# Altium project Ultrascale.PrjPcb (part 1 of 9)
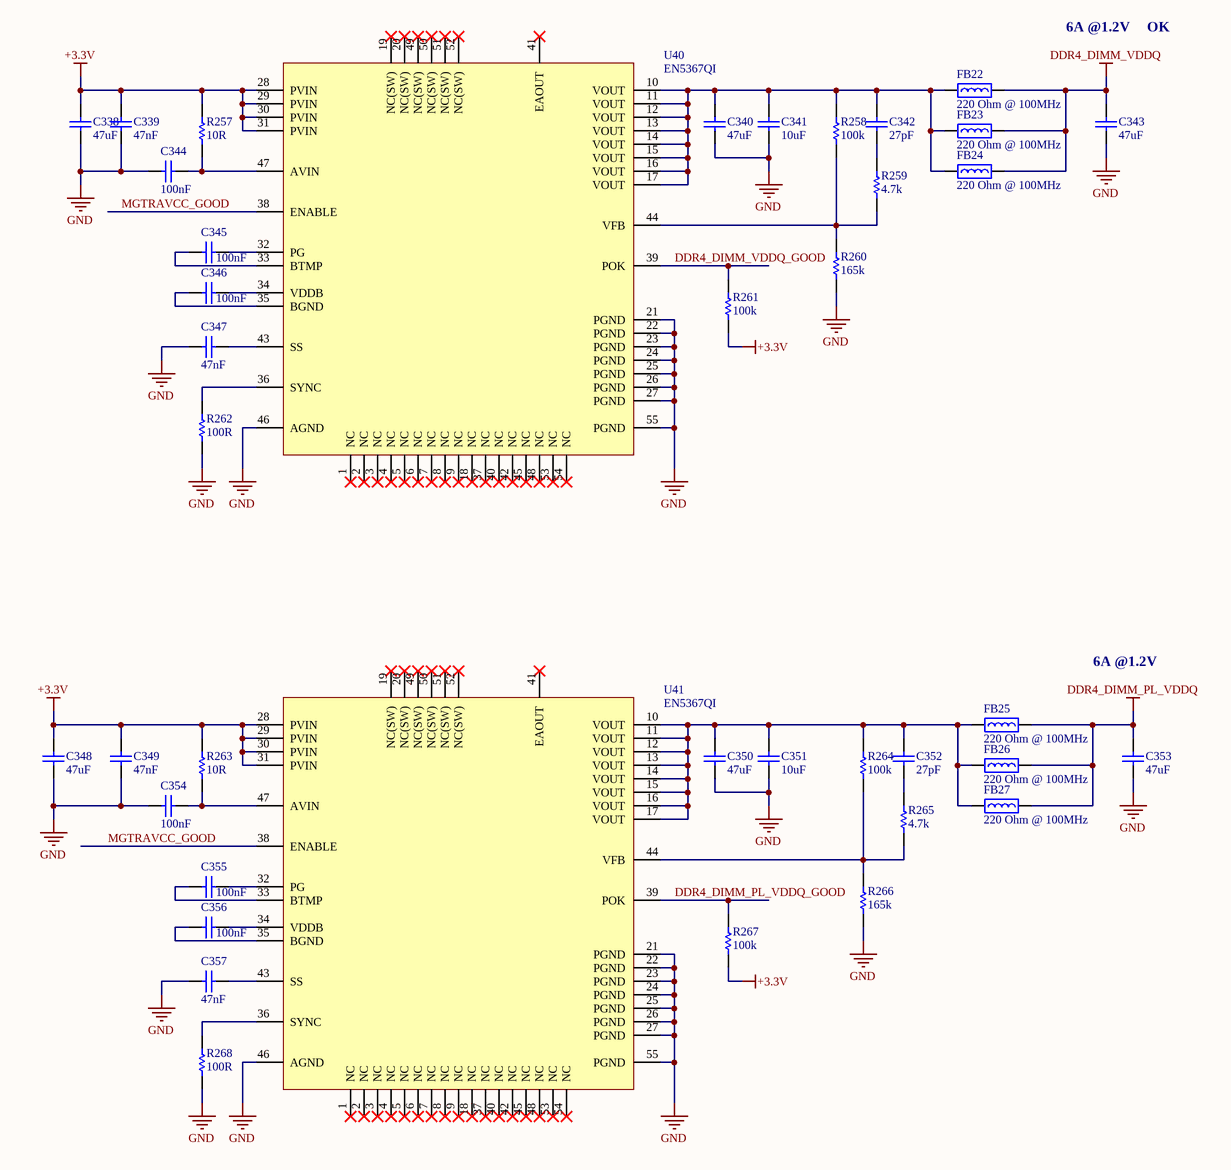
[diagram p0: Power1.SchDoc]
24 sheets, 926 parts. Net scope: global (net labels, ports and power ports of the same name join across sheets).
Board file: PCB1.PcbDoc
Sheets:
  Power1.SchDoc
  Power2.SchDoc
  Power3.SchDoc
  Power4.SchDoc
  DDR4_SODIMM_PWR.SchDoc
  Zynq_Power.SchDoc
  QSPI_EMMC_MICROSD.SchDoc
  JTAG.SchDoc
  SYSMON.SchDoc
  PS_DDR4_SODIMM.SchDoc
  PL_DDR4_SODIMM.SchDoc
  PS_DDR4.SchDoc
  PL_DDR4.SchDoc
  PS_GTR.SchDoc
  DisplayPort.SchDoc
  PL_IO.SchDoc
  PS_MIO.SchDoc
  USB3.0_UART.SchDoc
  PMOD_ARD_RASP.SchDoc
  eMMC_TPM.SchDoc
  Eth_Switch.SchDoc
  Eth_Switch_RJ45.SchDoc
  WIFI_BT.SchDoc
  ETH-PHY.SchDoc

## Sheet Power1.SchDoc
size A3

### Parts
C338  47uF  [CAPC3216L_1206]
C339  47nF  [CAPC2012L_0805]
C340  47uF  [CAPC3216L_1206]
C341  10uF  [CAPC1005L_0402]
C342  27pF  [CAPC1005L_0402]
C343  47uF  [CAPC3216L_1206]
C344  100nF  [CAPC1005L_0402]
C345  100nF  [CAPC1005L_0402]
C346  100nF  [CAPC1005L_0402]
C347  47nF  [CAPC2012L_0805]
C348  47uF  [CAPC3216L_1206]
C349  47nF  [CAPC2012L_0805]
C350  47uF  [CAPC3216L_1206]
C351  10uF  [CAPC1005L_0402]
C352  27pF  [CAPC1005L_0402]
C353  47uF  [CAPC3216L_1206]
C354  100nF  [CAPC1005L_0402]
C355  100nF  [CAPC1005L_0402]
C356  100nF  [CAPC1005L_0402]
C357  47nF  [CAPC2012L_0805]
FB22  Impedance @ Frequency: 220 Ohm @ 100MHz  [INDC1608N_0603]  (hidden comment: BEAD0603_220_2A5_40M)
FB23  Impedance @ Frequency: 220 Ohm @ 100MHz  [INDC1608N_0603]  (hidden comment: BEAD0603_220_2A5_40M)
FB24  Impedance @ Frequency: 220 Ohm @ 100MHz  [INDC1608N_0603]  (hidden comment: BEAD0603_220_2A5_40M)
FB25  Impedance @ Frequency: 220 Ohm @ 100MHz  [INDC1608N_0603]  (hidden comment: BEAD0603_220_2A5_40M)
FB26  Impedance @ Frequency: 220 Ohm @ 100MHz  [INDC1608N_0603]  (hidden comment: BEAD0603_220_2A5_40M)
FB27  Impedance @ Frequency: 220 Ohm @ 100MHz  [INDC1608N_0603]  (hidden comment: BEAD0603_220_2A5_40M)
R257  value 10R  [RESC1005L_0402]  (hidden comment: RES0402_10R_0W1_1T)
R258  value 100k  [RESC1005L_0402]  (hidden comment: RES0402_100K_0W2_1T)
R259  value 4.7k  [RESC1005L_0402]  (hidden comment: RES0402_4K7_0W1_1T)
R260  value 165k  [RESC1005L_0402]  (hidden comment: RES0402_165K_0W1_1T)
R261  value 100k  [RESC1005L_0402]  (hidden comment: RES0402_100K_0W2_1T)
R262  value 100R  [RESC1005L_0402]  (hidden comment: RES0402_100R_0W1_1T)
R263  value 10R  [RESC1005L_0402]  (hidden comment: RES0402_10R_0W1_1T)
R264  value 100k  [RESC1005L_0402]  (hidden comment: RES0402_100K_0W2_1T)
R265  value 4.7k  [RESC1005L_0402]  (hidden comment: RES0402_4K7_0W1_1T)
R266  value 165k  [RESC1005L_0402]  (hidden comment: RES0402_165K_0W1_1T)
R267  value 100k  [RESC1005L_0402]  (hidden comment: RES0402_100K_0W2_1T)
R268  value 100R  [RESC1005L_0402]  (hidden comment: RES0402_100R_0W1_1T)
U40  EN5367QI  [QFN54-EN5367QI]
U41  EN5367QI  [QFN54-EN5367QI]

### Nets
+3.3V: C338.2 C339.2 C348.2 C349.2 R257.2 R261.2 R263.2 R267.2 U40.28(PVIN) U40.29(PVIN) U40.30(PVIN) U40.31(PVIN) U41.28(PVIN) U41.29(PVIN) U41.30(PVIN) U41.31(PVIN)
DDR4_DIMM_PL_VDDQ: C353.2 FB25.2 FB26.2 FB27.2  [project net +VCCO_HP_64]
DDR4_DIMM_VDDQ: C343.2 FB22.2 FB23.2 FB24.2
GND: C338.1 C339.1 C340.1 C341.1 C343.1 C344.2 C347.2 C348.1 C349.1 C350.1 C351.1 C353.1 C354.2 C357.2 R260.1 R262.2 R266.1 R268.2 U40.21(PGND) U40.22(PGND) U40.23(PGND) U40.24(PGND) U40.25(PGND) U40.26(PGND) U40.27(PGND) U40.46(AGND) U40.55(PGND) U41.21(PGND) U41.22(PGND) U41.23(PGND) U41.24(PGND) U41.25(PGND) U41.26(PGND) U41.27(PGND) U41.46(AGND) U41.55(PGND)
DDR4_DIMM_PL_VDDQ_GOOD: R267.1 U41.39(POK)
DDR4_DIMM_VDDQ_GOOD: R261.1 U40.39(POK)
MGTRAVCC_GOOD: U40.38(ENABLE) U41.38(ENABLE)
NetC340_2: C340.2 C341.2 C342.2 FB22.1 FB23.1 FB24.1 R258.2 U40.10(VOUT) U40.11(VOUT) U40.12(VOUT) U40.13(VOUT) U40.14(VOUT) U40.15(VOUT) U40.16(VOUT) U40.17(VOUT)
NetC342_1: C342.1 R259.2
NetC344_1: C344.1 R257.1 U40.47(AVIN)
NetC345_1: C345.1 U40.32(PG)
NetC345_2: C345.2 U40.33(BTMP)
NetC346_1: C346.1 U40.34(VDDB)
NetC346_2: C346.2 U40.35(BGND)
NetC347_1: C347.1 U40.43(SS)
NetC350_2: C350.2 C351.2 C352.2 FB25.1 FB26.1 FB27.1 R264.2 U41.10(VOUT) U41.11(VOUT) U41.12(VOUT) U41.13(VOUT) U41.14(VOUT) U41.15(VOUT) U41.16(VOUT) U41.17(VOUT)
NetC352_1: C352.1 R265.2
NetC354_1: C354.1 R263.1 U41.47(AVIN)
NetC355_1: C355.1 U41.32(PG)
NetC355_2: C355.2 U41.33(BTMP)
NetC356_1: C356.1 U41.34(VDDB)
NetC356_2: C356.2 U41.35(BGND)
NetC357_1: C357.1 U41.43(SS)
NetR258_1: R258.1 R259.1 R260.2 U40.44(VFB)
NetR262_1: R262.1 U40.36(SYNC)
NetR264_1: R264.1 R265.1 R266.2 U41.44(VFB)
NetR268_1: R268.1 U41.36(SYNC)

Not connected (* = marked no-connect by the designer): U40 1(NC)* 2(NC)* 3(NC)* 4(NC)* 5(NC)* 6(NC)* 7(NC)* 8(NC)* 9(NC)* 18(NC)* 19(NC(SW))* 20(NC(SW))* 37(NC)* 40(NC)* 41(EAOUT)* 42(NC)* 45(NC)* 48(NC)* 49(NC(SW))* 50(NC(SW))* 51(NC(SW))* 52(NC(SW))* 53(NC)* 54(NC)*; U41 1(NC)* 2(NC)* 3(NC)* 4(NC)* 5(NC)* 6(NC)* 7(NC)* 8(NC)* 9(NC)* 18(NC)* 19(NC(SW))* 20(NC(SW))* 37(NC)* 40(NC)* 41(EAOUT)* 42(NC)* 45(NC)* 48(NC)* 49(NC(SW))* 50(NC(SW))* 51(NC(SW))* 52(NC(SW))* 53(NC)* 54(NC)*

### Notes on the sheet
- 6A @1.2V
- OK

### Library data of the parts
C338 C340 C343 C348 C350 C353 = CAPCER1206X5R47U25V_20T: CAP CER 47UF 25V X5R 1206; Manufacturer 1: TDK Corporation; Manufacturer Part Number 1: C3216X5R1E476M160AC; Tolerance: 20%; Package: 1206; ComponentLink1Description: Datasheet; Value: 47uF; Voltage: 25V; Temperature Coefficient: X5R; Supplier 1: Digi-Key; Supplier Part Number 1: 445-8047-1-ND; Operating Temperature: -55°C ~ 85°C
C339 C347 C349 C357 = CAPCER0805X5R47N50V_10T: CAP CER 0.047UF 50V X7R 0805; Manufacturer 1: Kemet; Manufacturer Part Number 1: C0805C473K5RACTU; Tolerance: 10%; Package: 0805; ComponentLink1Description: Datasheet; Value: 47nF; Voltage: 50V; Temperature Coefficient: X7R; Supplier 1: Digi-Key; Supplier Part Number 1: 399-1166-1-ND; Operating Temperature: -55°C ~ 125°C
C341 C351 = CAPCER0402X5R10U10V_20T: CAP CER 10UF 10V X5R 0402; Manufacturer 1: Samsung Electro-Mechanics America, Inc.; Manufacturer Part Number 1: CL05A106MP5NUNC; Tolerance: 20%; Package: 0402; ComponentLink1Description: Datasheet; Value: 10uF; Voltage: 10V; Temperature Coefficient: X5R; Supplier 1: Digi-Key; Supplier Part Number 1: 1276-1450-1-ND; Operating Temperature: -55°C ~ 85°C
C342 C352 = CAPCER0402C0G27P50V_5T: CAP CER 27PF 50V C0G/NP0 0402; Manufacturer 1: Murata Electronics North America; Manufacturer Part Number 1: GRM1555C1H270JA01D; Tolerance: 5%; Package: 0402; ComponentLink1Description: Datasheet; Value: 27pF; Voltage: 50V; Temperature Coefficient: C0G/NP0; Supplier 1: Digi-Key; Supplier Part Number 1: 490-5869-1-ND; Operating Temperature: -55°C ~ 125°C
C344-C346 C354-C356 = CAPCER0402X7R100N25V_10T: CAP CER 0.1UF 25V X7R 0402; Manufacturer 1: Murata Electronics North America; Manufacturer Part Number 1: GRM155R71E104KE14D; Tolerance: 10%; Package: 0402; ComponentLink1Description: Datasheet; Value: 100nF; Voltage: 25V; Temperature Coefficient: X7R; Supplier 1: Digi-Key; Supplier Part Number 1: 490-10698-1-ND; Operating Temperature: -55°C ~ 125°C
FB22-FB27 = BEAD0603_220_2A5_40M: FERRITE BEAD 220 OHM 0603 1LN; Manufacturer 1: Murata Electronics North America; Manufacturer Part Number 1: BLM18SG221TN1D; Current Rating (Max): 2.5A; DC Resistance (DCR) (Max): 40 mohm; Package: 0603; ComponentLink1Description: Datasheet; ComponentLink1URL: C:\Users\Public\Documents\Altium\AD16\Library\PDF\ENFA0003.pdf; Supplier 1: Digi-Key; Supplier Part Number 1: 490-5225-1-ND; Operating Temperature: -55°C ~ 125°C
R257 R263 = RES0402_10R_0W1_1T: RES SMD 10 OHM 1% 1/10W 0402; Manufacturer 1: Panasonic Electronic Components; Manufacturer Part Number 1: ERJ-2RKF10R0X; Package: 0402; ComponentLink1Description: Datasheet; Power: 1/10W; Tolerance: 1%; Supplier 1: Digi-Key; Supplier Part Number 1: P10.0LCT-ND
R258 R261 R264 R267 = RES0402_100K_0W2_1T: RES SMD 100K OHM 1% 1/5W 0402; Manufacturer 1: Vishay Dale; Manufacturer Part Number 1: RCS0402100KFKED; Package: 0402; ComponentLink1Description: Datasheet; Power: 1/5W; Tolerance: 1%; Supplier 1: Digi-Key; Supplier Part Number 1: 541-2899-1-ND
R259 R265 = RES0402_4K7_0W1_1T: RES SMD 4.7K OHM 1% 1/10W 0402; Manufacturer 1: Panasonic Electronic Components; Manufacturer Part Number 1: ERJ-2RKF4701X; Package: 0402; ComponentLink1Description: Datasheet; Power: 1/10W; Tolerance: 1%; Supplier 1: Digi-Key; Supplier Part Number 1: P4.70KLCT-ND
R260 R266 = RES0402_165K_0W1_1T: RES SMD 165K OHM 1% 1/10W 0402; Manufacturer 1: Panasonic Electronic Components; Manufacturer Part Number 1: ERJ-2RKF1653X; Package: 0402; ComponentLink1Description: Datasheet; Power: 1/10W; Tolerance: ±1%; Supplier 1: Digikey; Supplier Part Number 1: P165KLCT-ND
R262 R268 = RES0402_100R_0W1_1T: RES SMD 100 OHM 1% 1/10W 0402; Manufacturer 1: Panasonic Electronic Components; Manufacturer Part Number 1: ERJ-2RKF1000X; Package: 0402; ComponentLink1Description: Datasheet; Power: 1/10W; Tolerance: 1%; Supplier 1: Digi-Key; Supplier Part Number 1: P100LCT-ND
U40 U41 = EN5367QI: DC/DC CONVERTER 0.6-4.9V 29W; Manufacturer 1: Altera; Voltage - Output: 0.6 ~ 4.9 V; Voltage - Input: 2.5V - 5.5V; ComponentLink1Description: Datasheet; ComponentLink1URL: C:\Users\Public\Documents\Altium\AD16\Library\PDF\en5367qi_07013.pdf; Supplier 1: Digi-Key; Supplier Part Number 1: 544-2858-1-ND; Manufacturer Part Number 1: EN5367QI; Operating Temperature: -40°C ~ 85°C

## Sheet Power2.SchDoc
size A3
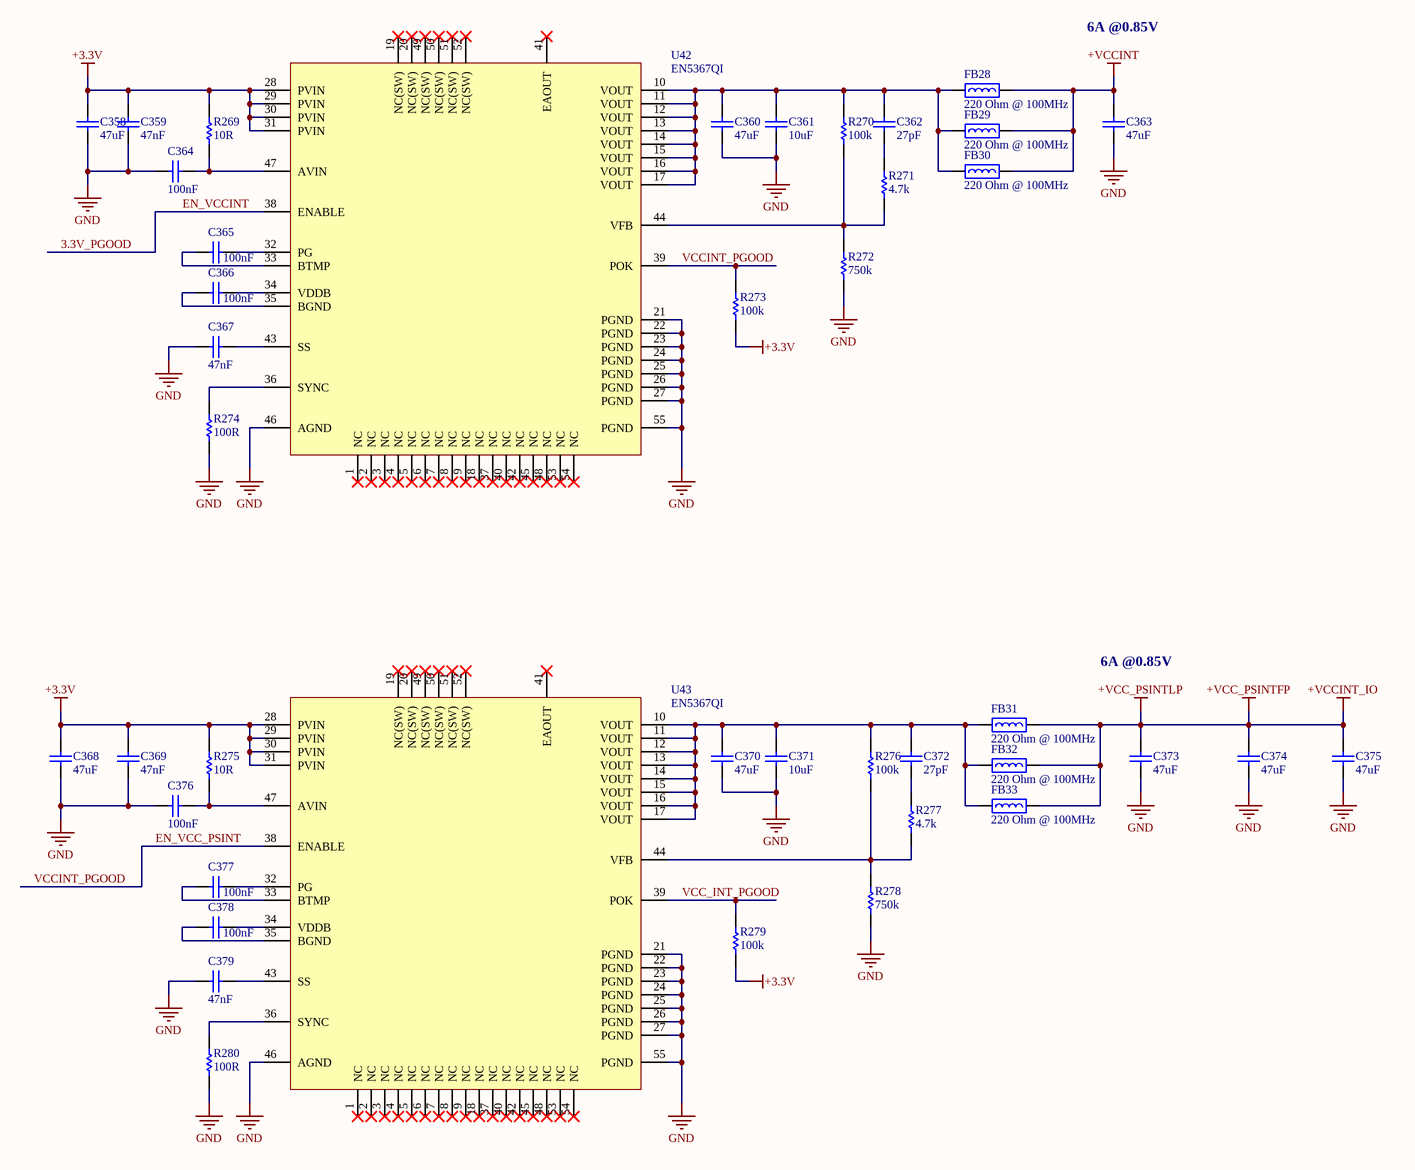
[diagram p1: Power2.SchDoc]

### Parts
C358  47uF  [CAPC3216L_1206]
C359  47nF  [CAPC2012L_0805]
C360  47uF  [CAPC3216L_1206]
C361  10uF  [CAPC1005L_0402]
C362  27pF  [CAPC1005L_0402]
C363  47uF  [CAPC3216L_1206]
C364  100nF  [CAPC1005L_0402]
C365  100nF  [CAPC1005L_0402]
C366  100nF  [CAPC1005L_0402]
C367  47nF  [CAPC2012L_0805]
C368  47uF  [CAPC3216L_1206]
C369  47nF  [CAPC2012L_0805]
C370  47uF  [CAPC3216L_1206]
C371  10uF  [CAPC1005L_0402]
C372  27pF  [CAPC1005L_0402]
C373  47uF  [CAPC3216L_1206]
C374  47uF  [CAPC3216L_1206]
C375  47uF  [CAPC3216L_1206]
C376  100nF  [CAPC1005L_0402]
C377  100nF  [CAPC1005L_0402]
C378  100nF  [CAPC1005L_0402]
C379  47nF  [CAPC2012L_0805]
FB28  Impedance @ Frequency: 220 Ohm @ 100MHz  [INDC1608N_0603]  (hidden comment: BEAD0603_220_2A5_40M)
FB29  Impedance @ Frequency: 220 Ohm @ 100MHz  [INDC1608N_0603]  (hidden comment: BEAD0603_220_2A5_40M)
FB30  Impedance @ Frequency: 220 Ohm @ 100MHz  [INDC1608N_0603]  (hidden comment: BEAD0603_220_2A5_40M)
FB31  Impedance @ Frequency: 220 Ohm @ 100MHz  [INDC1608N_0603]  (hidden comment: BEAD0603_220_2A5_40M)
FB32  Impedance @ Frequency: 220 Ohm @ 100MHz  [INDC1608N_0603]  (hidden comment: BEAD0603_220_2A5_40M)
FB33  Impedance @ Frequency: 220 Ohm @ 100MHz  [INDC1608N_0603]  (hidden comment: BEAD0603_220_2A5_40M)
R269  value 10R  [RESC1005L_0402]  (hidden comment: RES0402_10R_0W1_1T)
R270  value 100k  [RESC1005L_0402]  (hidden comment: RES0402_100K_0W2_1T)
R271  value 4.7k  [RESC1005L_0402]  (hidden comment: RES0402_4K7_0W1_1T)
R272  value 750k  [RESC1005L_0402]  (hidden comment: RES0402_750K_0W1_1T)
R273  value 100k  [RESC1005L_0402]  (hidden comment: RES0402_100K_0W2_1T)
R274  value 100R  [RESC1005L_0402]  (hidden comment: RES0402_100R_0W1_1T)
R275  value 10R  [RESC1005L_0402]  (hidden comment: RES0402_10R_0W1_1T)
R276  value 100k  [RESC1005L_0402]  (hidden comment: RES0402_100K_0W2_1T)
R277  value 4.7k  [RESC1005L_0402]  (hidden comment: RES0402_4K7_0W1_1T)
R278  value 750k  [RESC1005L_0402]  (hidden comment: RES0402_750K_0W1_1T)
R279  value 100k  [RESC1005L_0402]  (hidden comment: RES0402_100K_0W2_1T)
R280  value 100R  [RESC1005L_0402]  (hidden comment: RES0402_100R_0W1_1T)
U42  EN5367QI  [QFN54-EN5367QI]
U43  EN5367QI  [QFN54-EN5367QI]

### Nets
+3.3V: C358.2 C359.2 C368.2 C369.2 R269.2 R273.2 R275.2 R279.2 U42.28(PVIN) U42.29(PVIN) U42.30(PVIN) U42.31(PVIN) U43.28(PVIN) U43.29(PVIN) U43.30(PVIN) U43.31(PVIN)
+VCC_PSINTFP: C373.2 C374.2 C375.2 FB31.2 FB32.2 FB33.2  [also labelled +VCC_PSINTLP, +VCCINT_IO]
+VCCINT: C363.2 FB28.2 FB29.2 FB30.2
GND: C358.1 C359.1 C360.1 C361.1 C363.1 C364.2 C367.2 C368.1 C369.1 C370.1 C371.1 C373.1 C374.1 C375.1 C376.2 C379.2 R272.1 R274.2 R278.1 R280.2 U42.21(PGND) U42.22(PGND) U42.23(PGND) U42.24(PGND) U42.25(PGND) U42.26(PGND) U42.27(PGND) U42.46(AGND) U42.55(PGND) U43.21(PGND) U43.22(PGND) U43.23(PGND) U43.24(PGND) U43.25(PGND) U43.26(PGND) U43.27(PGND) U43.46(AGND) U43.55(PGND)
3.3V_PGOOD: U42.38(ENABLE)  [also labelled EN_VCCINT]
EN_VCC_PSINT: R273.1 U42.39(POK) U43.38(ENABLE)  [also labelled VCCINT_PGOOD]
VCC_INT_PGOOD: R279.1 U43.39(POK)
NetC360_2: C360.2 C361.2 C362.2 FB28.1 FB29.1 FB30.1 R270.2 U42.10(VOUT) U42.11(VOUT) U42.12(VOUT) U42.13(VOUT) U42.14(VOUT) U42.15(VOUT) U42.16(VOUT) U42.17(VOUT)
NetC362_1: C362.1 R271.2
NetC364_1: C364.1 R269.1 U42.47(AVIN)
NetC365_1: C365.1 U42.32(PG)
NetC365_2: C365.2 U42.33(BTMP)
NetC366_1: C366.1 U42.34(VDDB)
NetC366_2: C366.2 U42.35(BGND)
NetC367_1: C367.1 U42.43(SS)
NetC370_2: C370.2 C371.2 C372.2 FB31.1 FB32.1 FB33.1 R276.2 U43.10(VOUT) U43.11(VOUT) U43.12(VOUT) U43.13(VOUT) U43.14(VOUT) U43.15(VOUT) U43.16(VOUT) U43.17(VOUT)
NetC372_1: C372.1 R277.2
NetC376_1: C376.1 R275.1 U43.47(AVIN)
NetC377_1: C377.1 U43.32(PG)
NetC377_2: C377.2 U43.33(BTMP)
NetC378_1: C378.1 U43.34(VDDB)
NetC378_2: C378.2 U43.35(BGND)
NetC379_1: C379.1 U43.43(SS)
NetR270_1: R270.1 R271.1 R272.2 U42.44(VFB)
NetR274_1: R274.1 U42.36(SYNC)
NetR276_1: R276.1 R277.1 R278.2 U43.44(VFB)
NetR280_1: R280.1 U43.36(SYNC)

Not connected (* = marked no-connect by the designer): U42 1(NC)* 2(NC)* 3(NC)* 4(NC)* 5(NC)* 6(NC)* 7(NC)* 8(NC)* 9(NC)* 18(NC)* 19(NC(SW))* 20(NC(SW))* 37(NC)* 40(NC)* 41(EAOUT)* 42(NC)* 45(NC)* 48(NC)* 49(NC(SW))* 50(NC(SW))* 51(NC(SW))* 52(NC(SW))* 53(NC)* 54(NC)*; U43 1(NC)* 2(NC)* 3(NC)* 4(NC)* 5(NC)* 6(NC)* 7(NC)* 8(NC)* 9(NC)* 18(NC)* 19(NC(SW))* 20(NC(SW))* 37(NC)* 40(NC)* 41(EAOUT)* 42(NC)* 45(NC)* 48(NC)* 49(NC(SW))* 50(NC(SW))* 51(NC(SW))* 52(NC(SW))* 53(NC)* 54(NC)*

### Notes on the sheet
- 6A @0.85V

### Library data of the parts
C358 C360 C363 C368 C370 C373-C375 = CAPCER1206X5R47U25V_20T: as C338 on sheet Power1; Package: 1206; ComponentLink1Description: Datasheet; Value: 47uF; Voltage: 25V; Temperature Coefficient: X5R; Supplier 1: Digi-Key; Supplier Part Number 1: 445-8047-1-ND; Operating Temperature: -55°C ~ 85°C
C359 C367 C369 C379 = CAPCER0805X5R47N50V_10T: as C339 on sheet Power1; Package: 0805; ComponentLink1Description: Datasheet; Value: 47nF; Voltage: 50V; Temperature Coefficient: X7R; Supplier 1: Digi-Key; Supplier Part Number 1: 399-1166-1-ND; Operating Temperature: -55°C ~ 125°C
C361 C371 = CAPCER0402X5R10U10V_20T: as C341 on sheet Power1; Package: 0402; ComponentLink1Description: Datasheet; Value: 10uF; Voltage: 10V; Temperature Coefficient: X5R; Supplier 1: Digi-Key; Supplier Part Number 1: 1276-1450-1-ND; Operating Temperature: -55°C ~ 85°C
C362 C372 = CAPCER0402C0G27P50V_5T: as C342 on sheet Power1; Package: 0402; ComponentLink1Description: Datasheet; Value: 27pF; Voltage: 50V; Temperature Coefficient: C0G/NP0; Supplier 1: Digi-Key; Supplier Part Number 1: 490-5869-1-ND; Operating Temperature: -55°C ~ 125°C
C364-C366 C376-C378 = CAPCER0402X7R100N25V_10T: as C344 on sheet Power1; Package: 0402; ComponentLink1Description: Datasheet; Value: 100nF; Voltage: 25V; Temperature Coefficient: X7R; Supplier 1: Digi-Key; Supplier Part Number 1: 490-10698-1-ND; Operating Temperature: -55°C ~ 125°C
FB28-FB33 = BEAD0603_220_2A5_40M: as FB22 on sheet Power1; Package: 0603; ComponentLink1Description: Datasheet; ComponentLink1URL: C:\Users\Public\Documents\Altium\AD16\Library\PDF\ENFA0003.pdf; Supplier 1: Digi-Key; Supplier Part Number 1: 490-5225-1-ND; Operating Temperature: -55°C ~ 125°C
R269 R275 = RES0402_10R_0W1_1T: as R257 on sheet Power1; Package: 0402; ComponentLink1Description: Datasheet; Power: 1/10W; Tolerance: 1%; Supplier 1: Digi-Key; Supplier Part Number 1: P10.0LCT-ND
R270 R273 R276 R279 = RES0402_100K_0W2_1T: as R258 on sheet Power1; Package: 0402; ComponentLink1Description: Datasheet; Power: 1/5W; Tolerance: 1%; Supplier 1: Digi-Key; Supplier Part Number 1: 541-2899-1-ND
R271 R277 = RES0402_4K7_0W1_1T: as R259 on sheet Power1; Package: 0402; ComponentLink1Description: Datasheet; Power: 1/10W; Tolerance: 1%; Supplier 1: Digi-Key; Supplier Part Number 1: P4.70KLCT-ND
R272 R278 = RES0402_750K_0W1_1T: RES SMD 750K OHM 1% 1/10W 0402; Manufacturer 1: Panasonic Electronic Components; Manufacturer Part Number 1: ERJ-2RKF7503X; Package: 0402; ComponentLink1Description: Datasheet; Power: 1/10W; Tolerance: 1%; Supplier 1: Digi-Key; Supplier Part Number 1: P750KLCT-ND
R274 R280 = RES0402_100R_0W1_1T: as R262 on sheet Power1; Package: 0402; ComponentLink1Description: Datasheet; Power: 1/10W; Tolerance: 1%; Supplier 1: Digi-Key; Supplier Part Number 1: P100LCT-ND
U42 U43 = EN5367QI: as U40 on sheet Power1; ComponentLink1Description: Datasheet; ComponentLink1URL: C:\Users\Public\Documents\Altium\AD16\Library\PDF\en5367qi_07013.pdf; Supplier 1: Digi-Key; Supplier Part Number 1: 544-2858-1-ND; Manufacturer Part Number 1: EN5367QI; Operating Temperature: -40°C ~ 85°C

## Sheet Power3.SchDoc
size A3
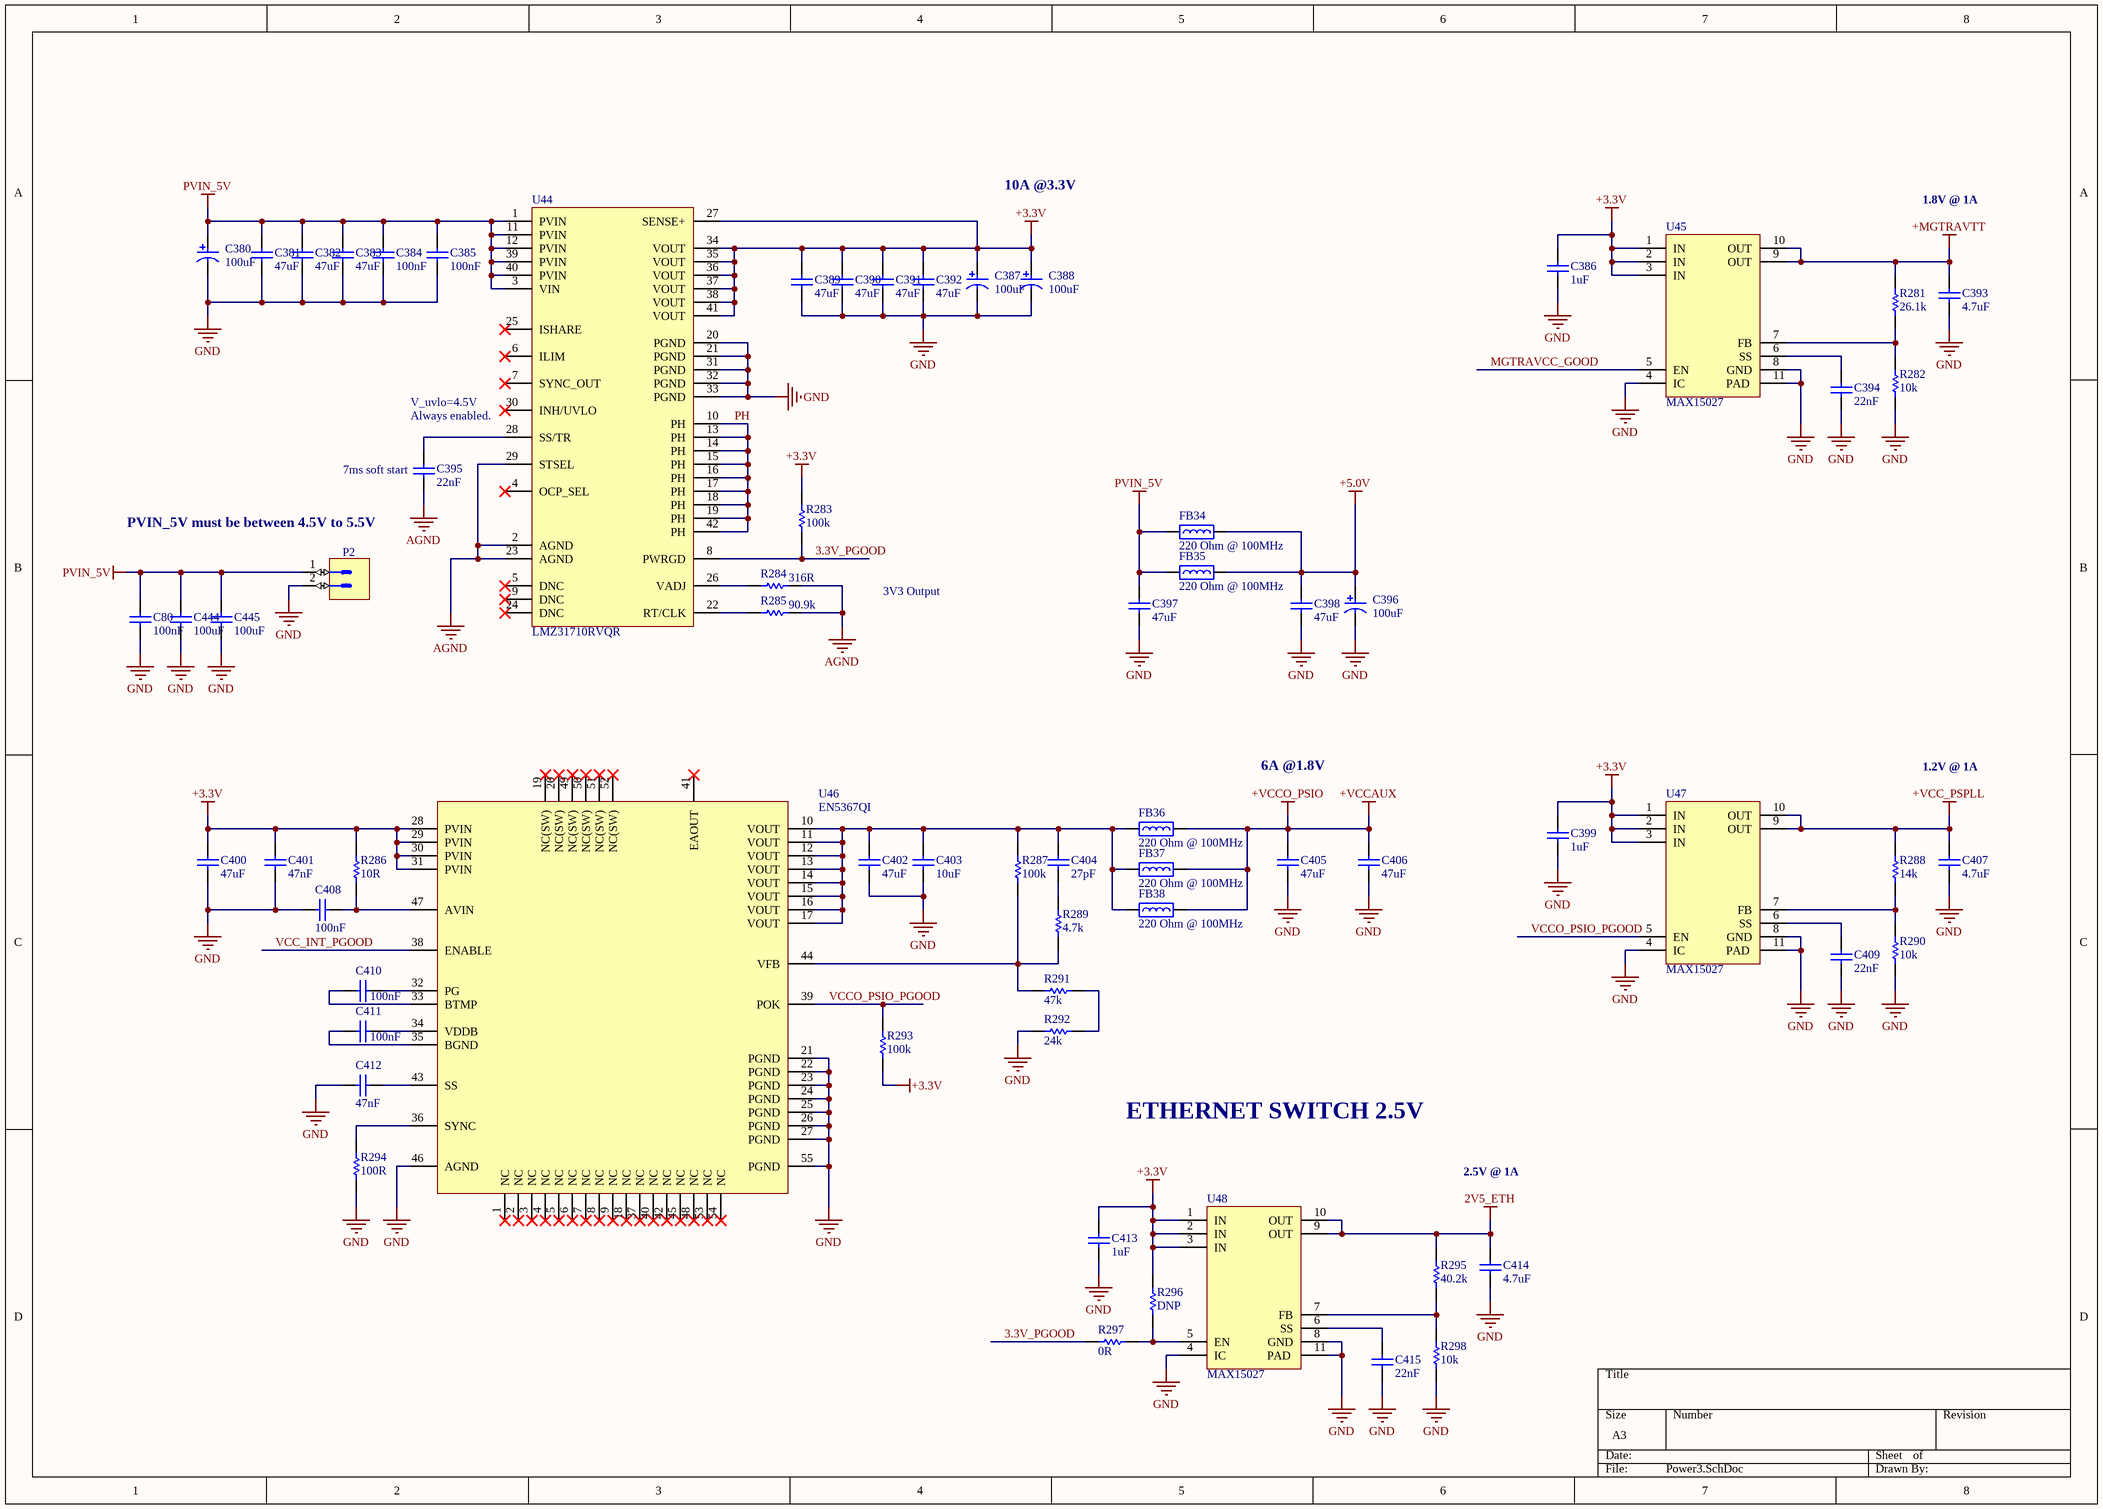
[diagram p2: Power3.SchDoc]

### Parts
C80  100nF  [CAPC1005L_0402]
C380  100uF  [AVX_TAN_F95_P_0905]
C381  47uF  [CAPC3216L_1206]
C382  47uF  [CAPC3216L_1206]
C383  47uF  [CAPC3216L_1206]
C384  100nF  [CAPC1005L_0402]
C385  100nF  [CAPC1005L_0402]
C386  1uF  [CAPC1005L_0402]
C387  100uF  [AVX_TAN_F95_P_0905]
C388  100uF  [AVX_TAN_F95_P_0905]
C389  47uF  [CAPC3216L_1206]
C390  47uF  [CAPC3216L_1206]
C391  47uF  [CAPC3216L_1206]
C392  47uF  [CAPC3216L_1206]
C393  4.7uF  [CAPC1005L_0402]
C394  22nF  [CAPC1005L_0402]
C395  22nF  [CAPC1005L_0402]
C396  100uF  [AVX_TAN_F95_P_0905]
C397  47uF  [CAPC3216L_1206]
C398  47uF  [CAPC3216L_1206]
C399  1uF  [CAPC1005L_0402]
C400  47uF  [CAPC3216L_1206]
C401  47nF  [CAPC2012L_0805]
C402  47uF  [CAPC3216L_1206]
C403  10uF  [CAPC1005L_0402]
C404  27pF  [CAPC1005L_0402]
C405  47uF  [CAPC3216L_1206]
C406  47uF  [CAPC3216L_1206]
C407  4.7uF  [CAPC1005L_0402]
C408  100nF  [CAPC1005L_0402]
C409  22nF  [CAPC1005L_0402]
C410  100nF  [CAPC1005L_0402]
C411  100nF  [CAPC1005L_0402]
C412  47nF  [CAPC2012L_0805]
C413  1uF  [CAPC1005L_0402]
C414  4.7uF  [CAPC1005L_0402]
C415  22nF  [CAPC1005L_0402]
C444  100uF  [CAPC3225N_1210]
C445  100uF  [CAPC3225N_1210]
FB34  Impedance @ Frequency: 220 Ohm @ 100MHz  [INDC1608N_0603]  (hidden comment: BEAD0603_220_2A5_40M)
FB35  Impedance @ Frequency: 220 Ohm @ 100MHz  [INDC1608N_0603]  (hidden comment: BEAD0603_220_2A5_40M)
FB36  Impedance @ Frequency: 220 Ohm @ 100MHz  [INDC1608N_0603]  (hidden comment: BEAD0603_220_2A5_40M)
FB37  Impedance @ Frequency: 220 Ohm @ 100MHz  [INDC1608N_0603]  (hidden comment: BEAD0603_220_2A5_40M)
FB38  Impedance @ Frequency: 220 Ohm @ 100MHz  [INDC1608N_0603]  (hidden comment: BEAD0603_220_2A5_40M)
P2  KK®  [MOLEX_26-60-4020]  (value not drawn)
R281  value 26.1k  [RESC1005L_0402]  (hidden comment: RES0402_26K1_0W1_1T)
R282  value 10k  [RESC1005L_0402]  (hidden comment: RES0402_10K_0W1_05T)
R283  value 100k  [RESC1005L_0402]  (hidden comment: RES0402_100K_0W2_1T)
R284  value 316R  [RESC1005L_0402]  (hidden comment: RES0402_316R_0W06_1T)
R285  value 90.9k  [RESC1005L_0402]  (hidden comment: RES0402_90K9_0W1_1T)
R286  value 10R  [RESC1005L_0402]  (hidden comment: RES0402_10R_0W1_1T)
R287  value 100k  [RESC1005L_0402]  (hidden comment: RES0402_100K_0W2_1T)
R288  value 14k  [RESC1005L_0402]  (hidden comment: RES0402_14K_0W1_1T)
R289  value 4.7k  [RESC1005L_0402]  (hidden comment: RES0402_4K7_0W1_1T)
R290  value 10k  [RESC1005L_0402]  (hidden comment: RES0402_10K_0W1_05T)
R291  value 47k  [RESC1005L_0402]  (hidden comment: RES0402_47K_0W1)
R292  value 24k  [RESC1005L_0402]  (hidden comment: RES0402_24K_0W1)
R293  value 100k  [RESC1005L_0402]  (hidden comment: RES0402_100K_0W2_1T)
R294  value 100R  [RESC1005L_0402]  (hidden comment: RES0402_100R_0W1_1T)
R295  value 40.2k  [RESC1005L_0402]  (hidden comment: RES0402_40K2_0W1_1T)
R296  value DNP  [RESC1005L_0402]  (hidden comment: RES0402)
R297  value 0R  [RESC1005L_0402]  (hidden comment: RES0402_0R)
R298  value 10k  [RESC1005L_0402]  (hidden comment: RES0402_10K_0W1_05T)
U44  LMZ31710RVQR  [LMZ31710RVQR]
U45  MAX15027  [MAX15027_T1033+1_V]
U46  EN5367QI  [QFN54-EN5367QI]
U47  MAX15027  [MAX15027_T1033+1_V]
U48  MAX15027  [MAX15027_T1033+1_V]

### Nets
2V5_ETH: C414.2 R295.2 U48.9(OUT) U48.10(OUT)
+3.3V: C386.2 C387.1 C388.1 C389.2 C390.2 C391.2 C392.2 C399.2 C400.2 C401.2 C413.2 R283.2 R286.2 R293.2 R296.2 U44.27(SENSE+) U44.34(VOUT) U44.35(VOUT) U44.36(VOUT) U44.37(VOUT) U44.38(VOUT) U44.41(VOUT) U45.1(IN) U45.2(IN) U45.3(IN) U46.28(PVIN) U46.29(PVIN) U46.30(PVIN) U46.31(PVIN) U47.1(IN) U47.2(IN) U47.3(IN) U48.1(IN) U48.2(IN) U48.3(IN)
+5.0V: C396.1 C398.2 FB34.2 FB35.2
+MGTRAVTT: C393.2 R281.2 U45.9(OUT) U45.10(OUT)
+VCC_PSPLL: C407.2 R288.2 U47.9(OUT) U47.10(OUT)
+VCCAUX: C405.2 C406.2 FB36.2 FB37.2 FB38.2  [also labelled +VCCO_PSIO]
AGND: C395.1 R284.2 R285.2 U44.2(AGND) U44.23(AGND) U44.29(STSEL)
GND: C80.2 C380.2 C381.1 C382.1 C383.1 C384.2 C385.2 C386.1 C387.2 C388.2 C389.1 C390.1 C391.1 C392.1 C393.1 C394.1 C396.2 C397.1 C398.1 C399.1 C400.1 C401.1 C402.1 C403.1 C405.1 C406.1 C407.1 C408.2 C409.1 C412.2 C413.1 C414.1 C415.1 C444.1 C445.1 P2.2 R282.1 R290.1 R292.1 R294.2 R298.1 U44.20(PGND) U44.21(PGND) U44.31(PGND) U44.32(PGND) U44.33(PGND) U45.4(IC) U45.8(GND) U45.11(PAD) U46.21(PGND) U46.22(PGND) U46.23(PGND) U46.24(PGND) U46.25(PGND) U46.26(PGND) U46.27(PGND) U46.46(AGND) U46.55(PGND) U47.4(IC) U47.8(GND) U47.11(PAD) U48.4(IC) U48.8(GND) U48.11(PAD)
PVIN_5V: C80.1 C380.1 C381.2 C382.2 C383.2 C384.1 C385.1 C397.2 C444.2 C445.2 FB34.1 FB35.1 P2.1 U44.1(PVIN) U44.3(VIN) U44.11(PVIN) U44.12(PVIN) U44.39(PVIN) U44.40(PVIN)
3.3V_PGOOD: R283.1 R297.1 U44.8(PWRGD)
MGTRAVCC_GOOD: U45.5(EN)
PH: U44.10(PH) U44.13(PH) U44.14(PH) U44.15(PH) U44.16(PH) U44.17(PH) U44.18(PH) U44.19(PH) U44.42(PH)
VCC_INT_PGOOD: U46.38(ENABLE)
VCCO_PSIO_PGOOD: R293.1 U46.39(POK) U47.5(EN)
NetC394_2: C394.2 U45.6(SS)
NetC395_2: C395.2 U44.28(SS/TR)
NetC402_2: C402.2 C403.2 C404.2 FB36.1 FB37.1 FB38.1 R287.2 U46.10(VOUT) U46.11(VOUT) U46.12(VOUT) U46.13(VOUT) U46.14(VOUT) U46.15(VOUT) U46.16(VOUT) U46.17(VOUT)
NetC404_1: C404.1 R289.2
NetC408_1: C408.1 R286.1 U46.47(AVIN)
NetC409_2: C409.2 U47.6(SS)
NetC410_1: C410.1 U46.32(PG)
NetC410_2: C410.2 U46.33(BTMP)
NetC411_1: C411.1 U46.34(VDDB)
NetC411_2: C411.2 U46.35(BGND)
NetC412_1: C412.1 U46.43(SS)
NetC415_2: C415.2 U48.6(SS)
NetR281_1: R281.1 R282.2 U45.7(FB)
NetR284_1: R284.1 U44.26(VADJ)
NetR285_1: R285.1 U44.22(RT/CLK)
NetR287_1: R287.1 R289.1 R291.2 U46.44(VFB)
NetR288_1: R288.1 R290.2 U47.7(FB)
NetR291_1: R291.1 R292.2
NetR294_1: R294.1 U46.36(SYNC)
NetR295_1: R295.1 R298.2 U48.7(FB)
NetR296_1: R296.1 R297.2 U48.5(EN)

Not connected (* = marked no-connect by the designer): U44 4(OCP_SEL)* 5(DNC)* 6(ILIM)* 7(SYNC_OUT)* 9(DNC)* 24(DNC)* 25(ISHARE)* 30(INH/UVLO)*; U46 1(NC)* 2(NC)* 3(NC)* 4(NC)* 5(NC)* 6(NC)* 7(NC)* 8(NC)* 9(NC)* 18(NC)* 19(NC(SW))* 20(NC(SW))* 37(NC)* 40(NC)* 41(EAOUT)* 42(NC)* 45(NC)* 48(NC)* 49(NC(SW))* 50(NC(SW))* 51(NC(SW))* 52(NC(SW))* 53(NC)* 54(NC)*

### Notes on the sheet
- 10A @3.3V
- 1.8V @ 1A
- V_uvlo=4.5V
- Always enabled.
- (near C395) 7ms soft start
- PVIN_5V must be between 4.5V to 5.5V
- 3V3 Output
- 6A @1.8V
- 1.2V @ 1A
- ETHERNET SWITCH 2.5V
- 2.5V @ 1A

### Library data of the parts
C80 C384 C385 C408 C410 C411 = CAPCER0402X7R100N25V_10T: as C344 on sheet Power1; Package: 0402; ComponentLink1Description: Datasheet; Value: 100nF; Voltage: 25V; Temperature Coefficient: X7R; Supplier 1: Digi-Key; Supplier Part Number 1: 490-10698-1-ND; Operating Temperature: -55°C ~ 125°C
C380 C387 C388 C396 = CAPELE0905TAN100U6V3_20T: CAP TANT 100UF 6.3V 20% 0805; Manufacturer 1: AVX Corporation; Manufacturer Part Number 1: F950J107MPAAQ2; Temperature Coefficient: Tantalum; ESR: 1.2 Ohm; Package: 0905 P; ComponentLink1Description: Datasheet; ComponentLink1URL: C:\Users\Public\Documents\Altium\AD16\Library\PDF\F95.pdf; Value: 100uF; Voltage: 6.3V; Tolerance: 20%; Supplier 1: Digi-Key; Supplier Part Number 1: 478-8393-1-ND; Operating Temperature: -55°C ~ 125°C
C381-C383 C389-C392 C397 C398 C400 C402 C405 C406 = CAPCER1206X5R47U25V_20T: as C338 on sheet Power1; Package: 1206; ComponentLink1Description: Datasheet; Value: 47uF; Voltage: 25V; Temperature Coefficient: X5R; Supplier 1: Digi-Key; Supplier Part Number 1: 445-8047-1-ND; Operating Temperature: -55°C ~ 85°C
C386 C399 C413 = CAPCER0402X5R1U16V_20T: CAP CER 1UF 16V X5R 0402; Manufacturer 1: Murata Electronics North America; Manufacturer Part Number 1: GRM155R61C105ME01D; Tolerance: 20%; Package: 0402; ComponentLink1Description: Datasheet; Value: 1uF; Voltage: 16V; Temperature Coefficient: X5R; Supplier 1: Digi-Key; Supplier Part Number 1: 490-10454-1-ND; Operating Temperature: -55°C ~ 85°C
C393 C407 C414 = CAPCER0402X5R4U710V_10T: CAP CER 4.7UF 10V X5R 0402; Manufacturer 1: TDK Corporation; Manufacturer Part Number 1: C1005X5R1A475K050BC; Tolerance: 10%; Package: 0402; ComponentLink1Description: Datasheet; Value: 4.7uF; Voltage: 10V; Temperature Coefficient: x5R; Supplier 1: Digi-Key; Supplier Part Number 1: 445-13820-1-ND; Operating Temperature: -55°C ~ 85°C
C394 C395 C409 C415 = CAPCER0402X7R22N50V_10T: CAP CER 0.022UF 50V X7R 0402; Manufacturer 1: Murata Electronics North America; Manufacturer Part Number 1: GRM155R71H223KA12D; Tolerance: 10%; Package: 0402; ComponentLink1Description: Datasheet; Value: 22nF; Voltage: 50V; Temperature Coefficient: X7R; Supplier 1: Digi-Key; Supplier Part Number 1: 490-3884-1-ND; Operating Temperature: -55°C ~ 125°C
C401 C412 = CAPCER0805X5R47N50V_10T: as C339 on sheet Power1; Package: 0805; ComponentLink1Description: Datasheet; Value: 47nF; Voltage: 50V; Temperature Coefficient: X7R; Supplier 1: Digi-Key; Supplier Part Number 1: 399-1166-1-ND; Operating Temperature: -55°C ~ 125°C
C403 = CAPCER0402X5R10U10V_20T: as C341 on sheet Power1; Package: 0402; ComponentLink1Description: Datasheet; Value: 10uF; Voltage: 10V; Temperature Coefficient: X5R; Supplier 1: Digi-Key; Supplier Part Number 1: 1276-1450-1-ND; Operating Temperature: -55°C ~ 85°C
C404 = CAPCER0402C0G27P50V_5T: as C342 on sheet Power1; Package: 0402; ComponentLink1Description: Datasheet; Value: 27pF; Voltage: 50V; Temperature Coefficient: C0G/NP0; Supplier 1: Digi-Key; Supplier Part Number 1: 490-5869-1-ND; Operating Temperature: -55°C ~ 125°C
C444 C445 = CAPCER1210X5R100U16V_20T: CAP CER 100UF 16V X5R 1210; Manufacturer 1: Taiyo Yuden; Manufacturer Part Number 1: EMK325ABJ107MM-T; Tolerance: 20%; Package: 1210; ComponentLink1Description: Datasheet; Value: 100uF; Voltage: 16V; Temperature Coefficient: X5R; Supplier 1: Digi-Key; Supplier Part Number 1: 587-3152-1-ND; Operating Temperature: -55°C ~ 85°C
FB34-FB38 = BEAD0603_220_2A5_40M: as FB22 on sheet Power1; Package: 0603; ComponentLink1Description: Datasheet; ComponentLink1URL: C:\Users\Public\Documents\Altium\AD16\Library\PDF\ENFA0003.pdf; Supplier 1: Digi-Key; Supplier Part Number 1: 490-5225-1-ND; Operating Temperature: -55°C ~ 125°C
P2 = MOLEX_26-60-4020: Connector 2 Male; Part Description: 3.96mm (.156") Pitch KK® Solid Header, Vertical, Friction Lock, 2 Circuits, Tin (Sn) Plating; Manufacturer: Molex, LLC; Manufacturer Part Number: 0026604020; Table: MOLEX; Number of Positions: 2; Connector Type: Header, Unshrouded; Pitch: 0.156" (3.96mm); Number of Positions Loaded: All; Part Number: MOLEX_26-60-4020; Component Kind: Standard; Component Type: Standard; Pin Count: 2; Family: KK®; Mounted: Yes; Socket: No; SMD: No; Status: None; ComponentHeight: 14.73mm; HelpURL: \\cern.ch\dfs\Applications\Altium\Datasheets\MOLEX_26-60-4020.pdf; Author: CERN DEM JLC; CreateDate: 6.04.2011; LatestRevisionDate: 6.04.2011; Contact Mating Length: 0.450" (11.43mm); Termination: Solder; Fastening Type: Friction Lock; Supplier Part Number: WM4620-ND; Contact Finish Thickness: 60µin (1.52µm); Mounting Type: Through Hole; Contact Type: Male Pin; Row Spacing: -; Supplier: Digi-Key; Contact Finish: Tin; Number of Rows: 1; RoHS: RoHS Compliant; Packaging: Bulk; Category: Connectors, Interconnects; Features: -; Color: Natural
R281 = RES0402_26K1_0W1_1T: RES SMD 26.1K OHM 1% 1/10W 0402; Manufacturer 1: Panasonic Electronic Components; Manufacturer Part Number 1: ERJ-2RKF2612X; Package: 0402; ComponentLink1Description: Datasheet; Power: 1/10W; Tolerance: 1%; Supplier 1: Digi-Key; Supplier Part Number 1: P26.1KLCT-ND
R282 R290 R298 = RES0402_10K_0W1_05T: RES SMD 10K OHM 0.5% 1/16W 0402; Manufacturer 1: Panasonic Electronic Components; Manufacturer Part Number 1: ERJ-2RHD1002X; Package: 0402; ComponentLink1Description: Datasheet; Power: 1/16W; Tolerance: 0.5%; Supplier 1: Digi-Key; Supplier Part Number 1: P15984CT-ND
R283 R287 R293 = RES0402_100K_0W2_1T: as R258 on sheet Power1; Package: 0402; ComponentLink1Description: Datasheet; Power: 1/5W; Tolerance: 1%; Supplier 1: Digi-Key; Supplier Part Number 1: 541-2899-1-ND
R284 = RES0402_316R_0W06_1T: RES SMD 316 OHM 1% 1/16W 0402; Manufacturer 1: Vishay Dale; Manufacturer Part Number 1: CRCW0402316RFKED; Package: 0402; ComponentLink1Description: Datasheet; Power: 1/16W; Tolerance: 1%; Supplier 1: Digi-Key; Supplier Part Number 1: 541-316LCT-ND
R285 = RES0402_90K9_0W1_1T: RES SMD 90.9K OHM 1% 1/10W 0402; Manufacturer 1: Panasonic Electronic Components; Manufacturer Part Number 1: ERJ-2RKF9092X; Package: 0402; ComponentLink1Description: Datasheet; Power: 1/10W; Tolerance: 1%; Supplier 1: Digi-Key; Supplier Part Number 1: P90.9KLCT-ND
R286 = RES0402_10R_0W1_1T: as R257 on sheet Power1; Package: 0402; ComponentLink1Description: Datasheet; Power: 1/10W; Tolerance: 1%; Supplier 1: Digi-Key; Supplier Part Number 1: P10.0LCT-ND
R288 = RES0402_14K_0W1_1T: RES SMD 14K OHM 1% 1/10W 0402; Manufacturer 1: Panasonic Electronic Components; Manufacturer Part Number 1: ERJ-2RKF1402X; Package: 0402; ComponentLink1Description: Datasheet; Power: 1/10W; Tolerance: 1%; Supplier 1: Digi-Key; Supplier Part Number 1: P14.0KLCT-ND
R289 = RES0402_4K7_0W1_1T: as R259 on sheet Power1; Package: 0402; ComponentLink1Description: Datasheet; Power: 1/10W; Tolerance: 1%; Supplier 1: Digi-Key; Supplier Part Number 1: P4.70KLCT-ND
R291 = RES0402_47K_0W1: RES SMD 47K OHM 1% 1/10W 0402; Manufacturer 1: Panasonic Electronic Components; Manufacturer Part Number 1: ERJ-2RKF4702X; Package: 0402; ComponentLink1Description: Datasheet; Power: 1/10W; Tolerance: 1%; Supplier 1: Digi-Key; Supplier Part Number 1: P47.0KLCT-ND
R292 = RES0402_24K_0W1: RES SMD 24K OHM 1% 1/10W 0402; Manufacturer 1: Panasonic Electronic Components; Manufacturer Part Number 1: ERJ-2RKF2402X; Package: 0402; ComponentLink1Description: Datasheet; Power: 1/10W; Tolerance: 1%; Supplier 1: Digi-Key; Supplier Part Number 1: P24.0KLCT-ND
R294 = RES0402_100R_0W1_1T: as R262 on sheet Power1; Package: 0402; ComponentLink1Description: Datasheet; Power: 1/10W; Tolerance: 1%; Supplier 1: Digi-Key; Supplier Part Number 1: P100LCT-ND
R295 = RES0402_40K2_0W1_1T: RES SMD 40.2K OHM 1% 1/10W 0402; Manufacturer 1: Panasonic Electronic Components; Manufacturer Part Number 1: ERJ-2RKF4022X; Package: 0402; ComponentLink1Description: Datasheet; Power: 1/10W; Tolerance: 1%; Supplier 1: Digi-Key; Supplier Part Number 1: P40.2KLCT-ND
R296 = RES0402: RES SMD 0402 Footprint; Package: 0402; ComponentLink1Description: Datasheet; Tolerance: -
R297 = RES0402_0R: RES SMD 0 OHM JUMPER 1/16W 0402; Manufacturer 1: Vishay Dale; Manufacturer Part Number 1: CRCW04020000Z0ED; Power: 0.063W, 1/16W; Package: 0402; ComponentLink1Description: Datasheet; Tolerance: -; Supplier 1: Digi-Key; Supplier Part Number 1: 541-0.0JCT-ND
U44 = LMZ31710RVQR: DC/DC CONVERTER 0.6-5.5V 55W; Manufacturer 1: Texas Instruments; ComponentLink1Description: Datasheet; ComponentLink1URL: C:\Users\Public\Documents\Altium\AD16\Library\PDF\lmz31710.pdf; Manufacturer Part Number 1: LMZ31710RVQR; Supplier 1: Digikey; Supplier Part Number 1: 296-43646-1-ND; Operating Temperature: -40°C ~ 85°C
U45 U47 U48 = MAX15027: IC REG LINEAR POS ADJ 1A 10TDFN; Manufacturer 1: Maxim Integrated; Manufacturer Part Number 1: MAX15027ATB+T; ComponentLink1Description: Datasheet; ComponentLink1URL: C:\Users\Public\Documents\Altium\AD16\Library\PDF\MAX15027-MAX15028.pdf; Supplier 1: Digi-Key; Supplier Part Number 1: MAX15027ATB+TCT-ND; Operating Temperature: -40°C ~ 125°C
U46 = EN5367QI: as U40 on sheet Power1; ComponentLink1Description: Datasheet; ComponentLink1URL: C:\Users\Public\Documents\Altium\AD16\Library\PDF\en5367qi_07013.pdf; Supplier 1: Digi-Key; Supplier Part Number 1: 544-2858-1-ND; Manufacturer Part Number 1: EN5367QI; Operating Temperature: -40°C ~ 85°C

## Sheet Power4.SchDoc
size A3
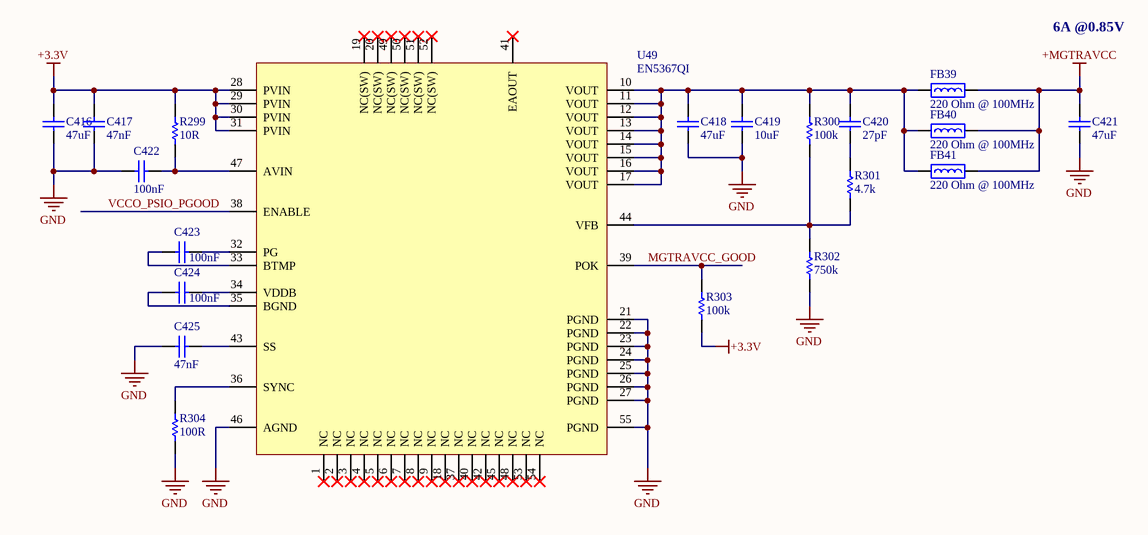
[diagram p3: Power4.SchDoc]

### Parts
C416  47uF  [CAPC3216L_1206]
C417  47nF  [CAPC2012L_0805]
C418  47uF  [CAPC3216L_1206]
C419  10uF  [CAPC1005L_0402]
C420  27pF  [CAPC1005L_0402]
C421  47uF  [CAPC3216L_1206]
C422  100nF  [CAPC1005L_0402]
C423  100nF  [CAPC1005L_0402]
C424  100nF  [CAPC1005L_0402]
C425  47nF  [CAPC2012L_0805]
FB39  Impedance @ Frequency: 220 Ohm @ 100MHz  [INDC1608N_0603]  (hidden comment: BEAD0603_220_2A5_40M)
FB40  Impedance @ Frequency: 220 Ohm @ 100MHz  [INDC1608N_0603]  (hidden comment: BEAD0603_220_2A5_40M)
FB41  Impedance @ Frequency: 220 Ohm @ 100MHz  [INDC1608N_0603]  (hidden comment: BEAD0603_220_2A5_40M)
R299  value 10R  [RESC1005L_0402]  (hidden comment: RES0402_10R_0W1_1T)
R300  value 100k  [RESC1005L_0402]  (hidden comment: RES0402_100K_0W2_1T)
R301  value 4.7k  [RESC1005L_0402]  (hidden comment: RES0402_4K7_0W1_1T)
R302  value 750k  [RESC1005L_0402]  (hidden comment: RES0402_750K_0W1_1T)
R303  value 100k  [RESC1005L_0402]  (hidden comment: RES0402_100K_0W2_1T)
R304  value 100R  [RESC1005L_0402]  (hidden comment: RES0402_100R_0W1_1T)
U49  EN5367QI  [QFN54-EN5367QI]

### Nets
+3.3V: C416.2 C417.2 R299.2 R303.2 U49.28(PVIN) U49.29(PVIN) U49.30(PVIN) U49.31(PVIN)
+MGTRAVCC: C421.2 FB39.2 FB40.2 FB41.2
GND: C416.1 C417.1 C418.1 C419.1 C421.1 C422.2 C425.2 R302.1 R304.2 U49.21(PGND) U49.22(PGND) U49.23(PGND) U49.24(PGND) U49.25(PGND) U49.26(PGND) U49.27(PGND) U49.46(AGND) U49.55(PGND)
MGTRAVCC_GOOD: R303.1 U49.39(POK)
VCCO_PSIO_PGOOD: U49.38(ENABLE)
NetC418_2: C418.2 C419.2 C420.2 FB39.1 FB40.1 FB41.1 R300.2 U49.10(VOUT) U49.11(VOUT) U49.12(VOUT) U49.13(VOUT) U49.14(VOUT) U49.15(VOUT) U49.16(VOUT) U49.17(VOUT)
NetC420_1: C420.1 R301.2
NetC422_1: C422.1 R299.1 U49.47(AVIN)
NetC423_1: C423.1 U49.32(PG)
NetC423_2: C423.2 U49.33(BTMP)
NetC424_1: C424.1 U49.34(VDDB)
NetC424_2: C424.2 U49.35(BGND)
NetC425_1: C425.1 U49.43(SS)
NetR300_1: R300.1 R301.1 R302.2 U49.44(VFB)
NetR304_1: R304.1 U49.36(SYNC)

Not connected (* = marked no-connect by the designer): U49 1(NC)* 2(NC)* 3(NC)* 4(NC)* 5(NC)* 6(NC)* 7(NC)* 8(NC)* 9(NC)* 18(NC)* 19(NC(SW))* 20(NC(SW))* 37(NC)* 40(NC)* 41(EAOUT)* 42(NC)* 45(NC)* 48(NC)* 49(NC(SW))* 50(NC(SW))* 51(NC(SW))* 52(NC(SW))* 53(NC)* 54(NC)*

### Notes on the sheet
- 6A @0.85V

### Library data of the parts
C416 C418 C421 = CAPCER1206X5R47U25V_20T: as C338 on sheet Power1; Package: 1206; ComponentLink1Description: Datasheet; Value: 47uF; Voltage: 25V; Temperature Coefficient: X5R; Supplier 1: Digi-Key; Supplier Part Number 1: 445-8047-1-ND; Operating Temperature: -55°C ~ 85°C
C417 C425 = CAPCER0805X5R47N50V_10T: as C339 on sheet Power1; Package: 0805; ComponentLink1Description: Datasheet; Value: 47nF; Voltage: 50V; Temperature Coefficient: X7R; Supplier 1: Digi-Key; Supplier Part Number 1: 399-1166-1-ND; Operating Temperature: -55°C ~ 125°C
C419 = CAPCER0402X5R10U10V_20T: as C341 on sheet Power1; Package: 0402; ComponentLink1Description: Datasheet; Value: 10uF; Voltage: 10V; Temperature Coefficient: X5R; Supplier 1: Digi-Key; Supplier Part Number 1: 1276-1450-1-ND; Operating Temperature: -55°C ~ 85°C
C420 = CAPCER0402C0G27P50V_5T: as C342 on sheet Power1; Package: 0402; ComponentLink1Description: Datasheet; Value: 27pF; Voltage: 50V; Temperature Coefficient: C0G/NP0; Supplier 1: Digi-Key; Supplier Part Number 1: 490-5869-1-ND; Operating Temperature: -55°C ~ 125°C
C422-C424 = CAPCER0402X7R100N25V_10T: as C344 on sheet Power1; Package: 0402; ComponentLink1Description: Datasheet; Value: 100nF; Voltage: 25V; Temperature Coefficient: X7R; Supplier 1: Digi-Key; Supplier Part Number 1: 490-10698-1-ND; Operating Temperature: -55°C ~ 125°C
FB39-FB41 = BEAD0603_220_2A5_40M: as FB22 on sheet Power1; Package: 0603; ComponentLink1Description: Datasheet; ComponentLink1URL: C:\Users\Public\Documents\Altium\AD16\Library\PDF\ENFA0003.pdf; Supplier 1: Digi-Key; Supplier Part Number 1: 490-5225-1-ND; Operating Temperature: -55°C ~ 125°C
R299 = RES0402_10R_0W1_1T: as R257 on sheet Power1; Package: 0402; ComponentLink1Description: Datasheet; Power: 1/10W; Tolerance: 1%; Supplier 1: Digi-Key; Supplier Part Number 1: P10.0LCT-ND
R300 R303 = RES0402_100K_0W2_1T: as R258 on sheet Power1; Package: 0402; ComponentLink1Description: Datasheet; Power: 1/5W; Tolerance: 1%; Supplier 1: Digi-Key; Supplier Part Number 1: 541-2899-1-ND
R301 = RES0402_4K7_0W1_1T: as R259 on sheet Power1; Package: 0402; ComponentLink1Description: Datasheet; Power: 1/10W; Tolerance: 1%; Supplier 1: Digi-Key; Supplier Part Number 1: P4.70KLCT-ND
R302 = RES0402_750K_0W1_1T: as R272 on sheet Power2; Package: 0402; ComponentLink1Description: Datasheet; Power: 1/10W; Tolerance: 1%; Supplier 1: Digi-Key; Supplier Part Number 1: P750KLCT-ND
R304 = RES0402_100R_0W1_1T: as R262 on sheet Power1; Package: 0402; ComponentLink1Description: Datasheet; Power: 1/10W; Tolerance: 1%; Supplier 1: Digi-Key; Supplier Part Number 1: P100LCT-ND
U49 = EN5367QI: as U40 on sheet Power1; ComponentLink1Description: Datasheet; ComponentLink1URL: C:\Users\Public\Documents\Altium\AD16\Library\PDF\en5367qi_07013.pdf; Supplier 1: Digi-Key; Supplier Part Number 1: 544-2858-1-ND; Manufacturer Part Number 1: EN5367QI; Operating Temperature: -40°C ~ 85°C

## Sheet DDR4_SODIMM_PWR.SchDoc
size A3
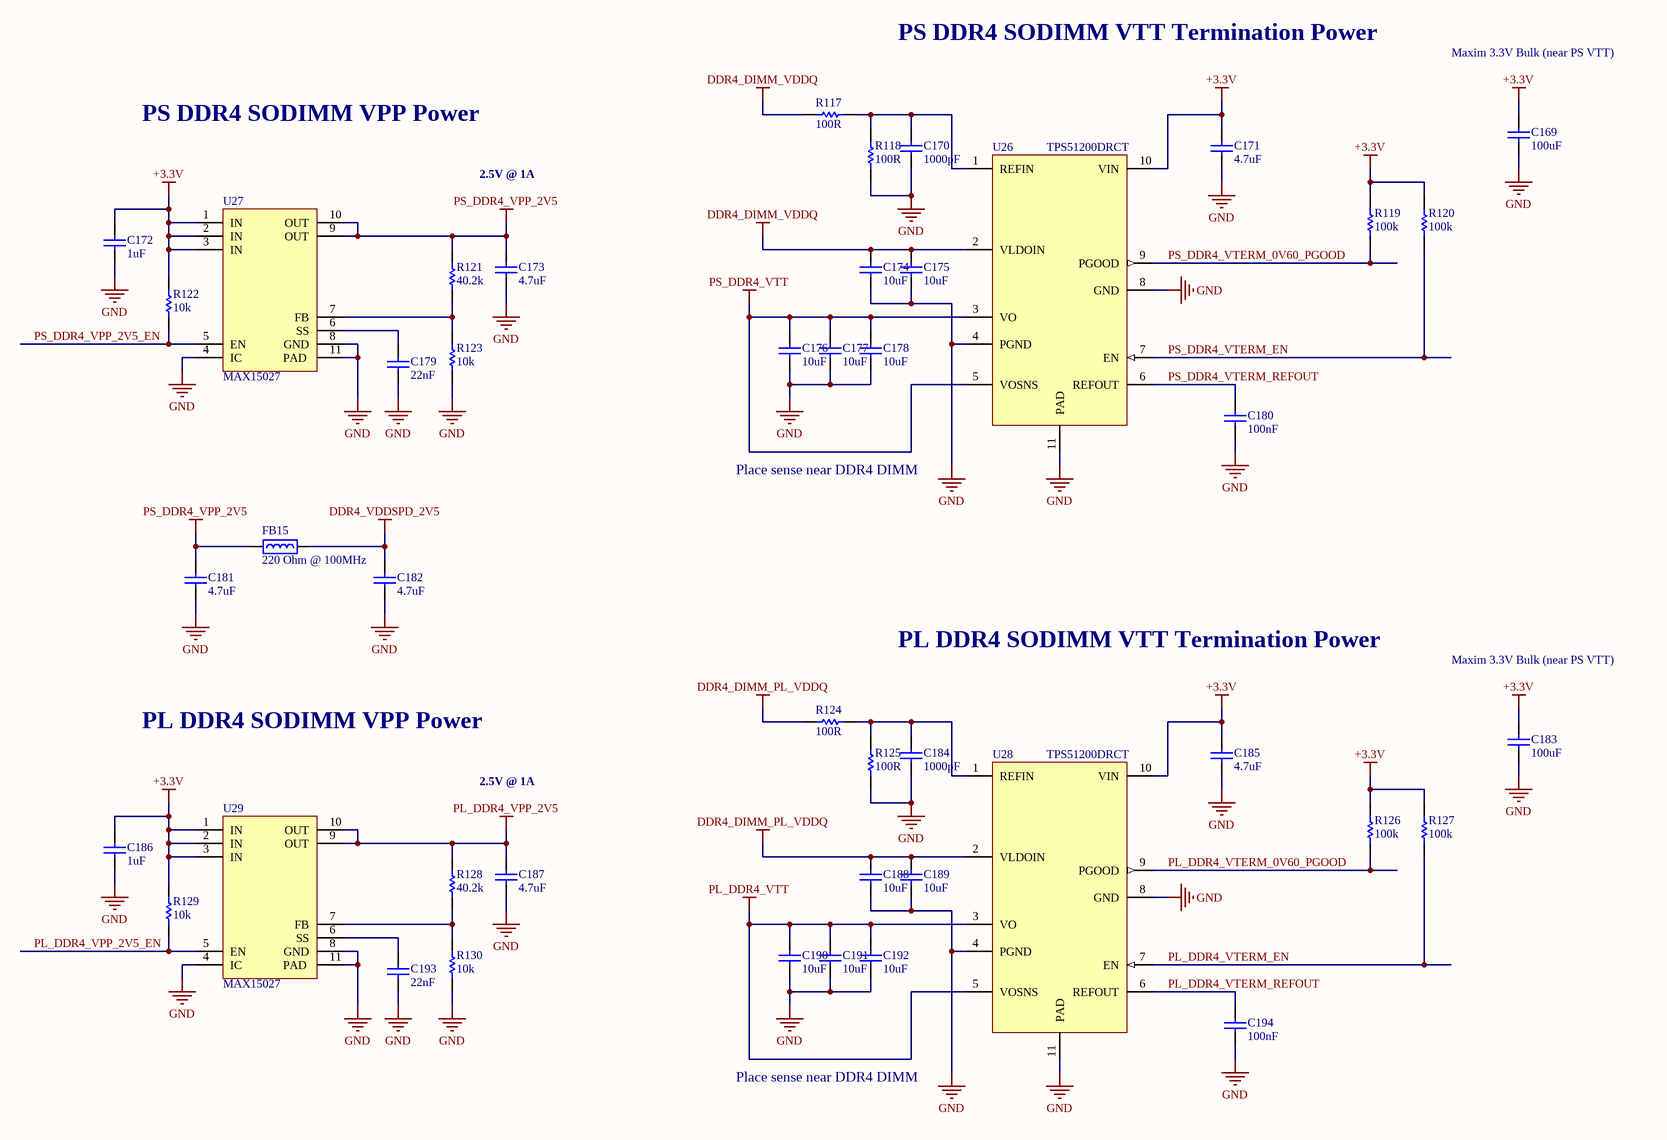
[diagram p4: DDR4_SODIMM_PWR.SchDoc]

### Parts
C169  100uF  [CAPC3225N_1210]
C170  1000pF  [CAPC1005L_0402]
C171  4.7uF  [CAPC1005L_0402]
C172  1uF  [CAPC1005L_0402]
C173  4.7uF  [CAPC1005L_0402]
C174  10uF  [CAPC1005L_0402]
C175  10uF  [CAPC1005L_0402]
C176  10uF  [CAPC1005L_0402]
C177  10uF  [CAPC1005L_0402]
C178  10uF  [CAPC1005L_0402]
C179  22nF  [CAPC1005L_0402]
C180  100nF  [CAPC1005L_0402]
C181  4.7uF  [CAPC1005L_0402]
C182  4.7uF  [CAPC1005L_0402]
C183  100uF  [CAPC3225N_1210]
C184  1000pF  [CAPC1005L_0402]
C185  4.7uF  [CAPC1005L_0402]
C186  1uF  [CAPC1005L_0402]
C187  4.7uF  [CAPC1005L_0402]
C188  10uF  [CAPC1005L_0402]
C189  10uF  [CAPC1005L_0402]
C190  10uF  [CAPC1005L_0402]
C191  10uF  [CAPC1005L_0402]
C192  10uF  [CAPC1005L_0402]
C193  22nF  [CAPC1005L_0402]
C194  100nF  [CAPC1005L_0402]
FB15  Impedance @ Frequency: 220 Ohm @ 100MHz  [INDC1608N_0603]  (hidden comment: BEAD0603_220_2A5_40M)
R117  value 100R  [RESC1005L_0402]  (hidden comment: RES0402_100R_0W1_1T)
R118  value 100R  [RESC1005L_0402]  (hidden comment: RES0402_100R_0W1_1T)
R119  value 100k  [RESC1005L_0402]  (hidden comment: RES0402_100K_0W2_1T)
R120  value 100k  [RESC1005L_0402]  (hidden comment: RES0402_100K_0W2_1T)
R121  value 40.2k  [RESC1005L_0402]  (hidden comment: RES0402_40K2_0W1_1T)
R122  value 10k  [RESC1005L_0402]  (hidden comment: RES0402_10K_0W1_05T)
R123  value 10k  [RESC1005L_0402]  (hidden comment: RES0402_10K_0W1_05T)
R124  value 100R  [RESC1005L_0402]  (hidden comment: RES0402_100R_0W1_1T)
R125  value 100R  [RESC1005L_0402]  (hidden comment: RES0402_100R_0W1_1T)
R126  value 100k  [RESC1005L_0402]  (hidden comment: RES0402_100K_0W2_1T)
R127  value 100k  [RESC1005L_0402]  (hidden comment: RES0402_100K_0W2_1T)
R128  value 40.2k  [RESC1005L_0402]  (hidden comment: RES0402_40K2_0W1_1T)
R129  value 10k  [RESC1005L_0402]  (hidden comment: RES0402_10K_0W1_05T)
R130  value 10k  [RESC1005L_0402]  (hidden comment: RES0402_10K_0W1_05T)
U26  TPS51200DRCT  [DRC_S-PVSON-N10]
U27  MAX15027  [MAX15027_T1033+1_V]
U28  TPS51200DRCT  [DRC_S-PVSON-N10]
U29  MAX15027  [MAX15027_T1033+1_V]

### Nets
+3.3V: C169.2 C171.2 C172.2 C183.2 C185.2 C186.2 R119.2 R120.2 R122.2 R126.2 R127.2 R129.2 U26.10(VIN) U27.1(IN) U27.2(IN) U27.3(IN) U28.10(VIN) U29.1(IN) U29.2(IN) U29.3(IN)
DDR4_DIMM_PL_VDDQ: C188.2 C189.2 R124.2 U28.2(VLDOIN)  [project net +VCCO_HP_64]
DDR4_DIMM_VDDQ: C174.2 C175.2 R117.2 U26.2(VLDOIN)
DDR4_VDDSPD_2V5: C182.2 FB15.2
GND: C169.1 C170.1 C171.1 C172.1 C173.1 C174.1 C175.1 C176.1 C177.1 C178.1 C179.1 C180.1 C181.1 C182.1 C183.1 C184.1 C185.1 C186.1 C187.1 C188.1 C189.1 C190.1 C191.1 C192.1 C193.1 C194.1 R118.2 R123.1 R125.2 R130.1 U26.4(PGND) U26.8(GND) U26.11(PAD) U27.4(IC) U27.8(GND) U27.11(PAD) U28.4(PGND) U28.8(GND) U28.11(PAD) U29.4(IC) U29.8(GND) U29.11(PAD)
PL_DDR4_VPP_2V5: C187.2 R128.2 U29.9(OUT) U29.10(OUT)
PL_DDR4_VTT: C190.2 C191.2 C192.2 U28.3(VO) U28.5(VOSNS)
PS_DDR4_VPP_2V5: C173.2 C181.2 FB15.1 R121.2 U27.9(OUT) U27.10(OUT)
PS_DDR4_VTT: C176.2 C177.2 C178.2 U26.3(VO) U26.5(VOSNS)
PL_DDR4_VPP_2V5_EN: R129.1 U29.5(EN)
PL_DDR4_VTERM_0V60_PGOOD: R126.1 U28.9(PGOOD)
PL_DDR4_VTERM_EN: R127.1 U28.7(EN)
PL_DDR4_VTERM_REFOUT: C194.2 U28.6(REFOUT)
PS_DDR4_VPP_2V5_EN: R122.1 U27.5(EN)
PS_DDR4_VTERM_0V60_PGOOD: R119.1 U26.9(PGOOD)
PS_DDR4_VTERM_EN: R120.1 U26.7(EN)
PS_DDR4_VTERM_REFOUT: C180.2 U26.6(REFOUT)
NetC170_2: C170.2 R117.1 R118.1 U26.1(REFIN)
NetC179_2: C179.2 U27.6(SS)
NetC184_2: C184.2 R124.1 R125.1 U28.1(REFIN)
NetC193_2: C193.2 U29.6(SS)
NetR121_1: R121.1 R123.2 U27.7(FB)
NetR128_1: R128.1 R130.2 U29.7(FB)

### Notes on the sheet
- PS DDR4 SODIMM VTT Termination Power
- Maxim 3.3V Bulk (near PS VTT)
- PS DDR4 SODIMM VPP Power
- 2.5V @ 1A
- Place sense near DDR4 DIMM
- PL DDR4 SODIMM VTT Termination Power
- PL DDR4 SODIMM VPP Power

### Library data of the parts
C169 C183 = CAPCER1210X5R100U16V_20T: as C444 on sheet Power3; Package: 1210; ComponentLink1Description: Datasheet; Value: 100uF; Voltage: 16V; Temperature Coefficient: X5R; Supplier 1: Digi-Key; Supplier Part Number 1: 587-3152-1-ND; Operating Temperature: -55°C ~ 85°C
C170 C184 = CAPCER0402X7R1000P50V_10T: CAP CER 1000PF 50V X7R 0402; Manufacturer 1: Murata Electronics North America; Manufacturer Part Number 1: GRM155R71H102KA01D; Tolerance: 10%; Package: 0402; ComponentLink1Description: Datasheet; Value: 1000pF; Voltage: 50V; Temperature Coefficient: X7R; Supplier 1: Digi-Key; Supplier Part Number 1: 490-1303-1-ND; Operating Temperature: -55°C ~ 125°C
C171 C173 C181 C182 C185 C187 = CAPCER0402X5R4U710V_10T: as C393 on sheet Power3; Package: 0402; ComponentLink1Description: Datasheet; Value: 4.7uF; Voltage: 10V; Temperature Coefficient: x5R; Supplier 1: Digi-Key; Supplier Part Number 1: 445-13820-1-ND; Operating Temperature: -55°C ~ 85°C
C172 C186 = CAPCER0402X5R1U16V_20T: as C386 on sheet Power3; Package: 0402; ComponentLink1Description: Datasheet; Value: 1uF; Voltage: 16V; Temperature Coefficient: X5R; Supplier 1: Digi-Key; Supplier Part Number 1: 490-10454-1-ND; Operating Temperature: -55°C ~ 85°C
C174-C178 C188-C192 = CAPCER0402X5R10U10V_20T: as C341 on sheet Power1; Package: 0402; ComponentLink1Description: Datasheet; Value: 10uF; Voltage: 10V; Temperature Coefficient: X5R; Supplier 1: Digi-Key; Supplier Part Number 1: 1276-1450-1-ND; Operating Temperature: -55°C ~ 85°C
C179 C193 = CAPCER0402X7R22N50V_10T: as C394 on sheet Power3; Package: 0402; ComponentLink1Description: Datasheet; Value: 22nF; Voltage: 50V; Temperature Coefficient: X7R; Supplier 1: Digi-Key; Supplier Part Number 1: 490-3884-1-ND; Operating Temperature: -55°C ~ 125°C
C180 C194 = CAPCER0402X7R100N25V_10T: as C344 on sheet Power1; Package: 0402; ComponentLink1Description: Datasheet; Value: 100nF; Voltage: 25V; Temperature Coefficient: X7R; Supplier 1: Digi-Key; Supplier Part Number 1: 490-10698-1-ND; Operating Temperature: -55°C ~ 125°C
FB15 = BEAD0603_220_2A5_40M: as FB22 on sheet Power1; Package: 0603; ComponentLink1Description: Datasheet; ComponentLink1URL: C:\Users\Public\Documents\Altium\AD16\Library\PDF\ENFA0003.pdf; Supplier 1: Digi-Key; Supplier Part Number 1: 490-5225-1-ND; Operating Temperature: -55°C ~ 125°C
R117 R118 R124 R125 = RES0402_100R_0W1_1T: as R262 on sheet Power1; Package: 0402; ComponentLink1Description: Datasheet; Power: 1/10W; Tolerance: 1%; Supplier 1: Digi-Key; Supplier Part Number 1: P100LCT-ND
R119 R120 R126 R127 = RES0402_100K_0W2_1T: as R258 on sheet Power1; Package: 0402; ComponentLink1Description: Datasheet; Power: 1/5W; Tolerance: 1%; Supplier 1: Digi-Key; Supplier Part Number 1: 541-2899-1-ND
R121 R128 = RES0402_40K2_0W1_1T: as R295 on sheet Power3; Package: 0402; ComponentLink1Description: Datasheet; Power: 1/10W; Tolerance: 1%; Supplier 1: Digi-Key; Supplier Part Number 1: P40.2KLCT-ND
R122 R123 R129 R130 = RES0402_10K_0W1_05T: as R282 on sheet Power3; Package: 0402; ComponentLink1Description: Datasheet; Power: 1/16W; Tolerance: 0.5%; Supplier 1: Digi-Key; Supplier Part Number 1: P15984CT-ND
U26 U28 = TPS51200DRCT: IC SINK/SOURCE DDR REG 10-SON; Manufacturer 1: Texas Instruments; ComponentLink1Description: Datasheet; ComponentLink1URL: C:\Users\Public\Documents\Altium\AD16\Library\PDF\tps51200.pdf; Supplier 1: Digi-Key; Supplier Part Number 1: 296-23830-1-ND; Manufacturer Part Number 1: TPS51200DRCT; Operating Temperature: -40°C ~ 85°C
U27 U29 = MAX15027: as U45 on sheet Power3; ComponentLink1Description: Datasheet; ComponentLink1URL: C:\Users\Public\Documents\Altium\AD16\Library\PDF\MAX15027-MAX15028.pdf; Supplier 1: Digi-Key; Supplier Part Number 1: MAX15027ATB+TCT-ND; Operating Temperature: -40°C ~ 125°C